# EAGLE design esp_wifi_switch (EAGLE 8.4.2)
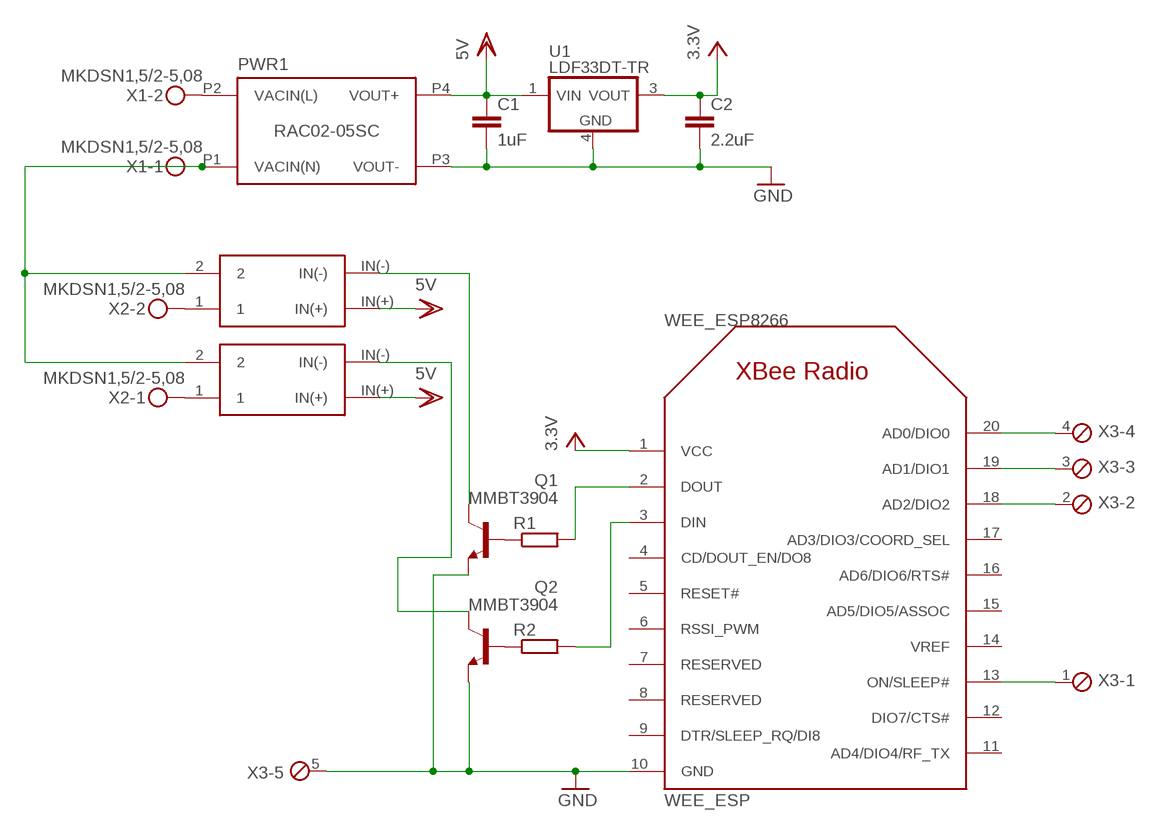
[diagram p0: schematic, sheet 1]

## Parts
C1  1uF  C-EUC3225  [C3225]
C2  2.2uF  C-EUC3225  [C3225]
PWR1  RAC02-05SC  [LOW_PROFILE_POWER_MODULE]
Q1  MMBT3904  BC849SMD  [SOT23-BEC]
Q2  MMBT3904  BC849SMD  [SOT23-BEC]
R1  R-EU_M1206  [M1206]
R2  R-EU_M1206  [M1206]
U1  LDF33DT-TR  MC7805BDT  [DPAK-3]
U$1  G3MB  [G3MB]
U$2  G3MB  [G3MB]
WEE_ESP8266  WEE_ESP  XBEE  [XBEE]
X1  MKDSN1,5/2-5,08  [MKDSN1,5/2-5,08]
X2  MKDSN1,5/2-5,08  [MKDSN1,5/2-5,08]
X3  MPT5  [5POL254]

## Nets
GND: C1.2 C2.2 PWR1.P3(VOUT-) Q1.E Q2.E U1.4(GND) WEE_ESP8266.10(GND) X3.5
N$1: PWR1.P2(VACIN(L)) X1.2
N$2: PWR1.P1(VACIN(N)) U$1.2 U$2.2 X1.1
N$3: U$1.1 X2.2
N$4: U$2.1 X2.1
N$5: WEE_ESP8266.13(ON/SLEEP#) X3.1
N$6: WEE_ESP8266.18(AD2/DIO2) X3.2
N$7: WEE_ESP8266.19(AD1/DIO1) X3.3
N$8: WEE_ESP8266.20(AD0/DIO0) X3.4
N$9: Q1.B R1.1
N$10: Q2.B R2.1
N$11: Q1.C U$1.IN(-)
N$12: R1.2 WEE_ESP8266.2(DOUT)
N$13: R2.2 WEE_ESP8266.3(DIN)
N$14: Q2.C U$2.IN(-)
VDD: C1.1 PWR1.P4(VOUT+) U1.1(VIN) U$1.IN(+) U$2.IN(+) ; supply symbol labelled 5V
VOUT: C2.1 U1.3(VOUT) WEE_ESP8266.1(VCC) ; supply symbol labelled 3.3V
Unconnected: WEE_ESP8266.4(CD/DOUT_EN/DO8) WEE_ESP8266.5(RESET#) WEE_ESP8266.6(RSSI_PWM) WEE_ESP8266.7(RESERVED) WEE_ESP8266.8(RESERVED) WEE_ESP8266.9(DTR/SLEEP_RQ/DI8) WEE_ESP8266.11(AD4/DIO4/RF_TX) WEE_ESP8266.12(DIO7/CTS#) WEE_ESP8266.14(VREF) WEE_ESP8266.15(AD5/DIO5/ASSOC) WEE_ESP8266.16(AD6/DIO6/RTS#) WEE_ESP8266.17(AD3/DIO3/COORD_SEL)

## Library data of the parts
C1 C2 = rcl:C-EU: CAPACITOR, European symbol
PWR1 = recom-powerline-acdc-converters:RAC*SC: RECOM POWERLINE AC/DC-Converter (RAC01-SC and RAC02-SC series) The RAC01-SC and RAC02-SC series are ultra-compact universal input AC/DC power modules for PCB mounting. They feature high efficiency, low standby power, high operating temperature, soft start and short-circuit protection as well as a built-in EMC Class B filter. Output voltages range from 3.3VDC to 24VDC. Datasheet <http://www.recom-power.com/pdf/Powerline-AC-DC/RAC01_02-SC.pdf>; INPUT_RANGE: 80 - 277 (VAC); MAX_CAPACITIVE_LOAD: 1200uF; OUTPUT_CURRENT: 400mA; OUTPUT_VOLTAGE: 5v
Q1 Q2 = transistor-npn:BC849*: NPN Transistor
R1 R2 = rcl:R-EU_: RESISTOR, European symbol
U1 = _hhn_78xx_79xx_NCV78xx_d2pak_dpak:MC78*: 78xx SMD (D2PAK, DPAK) (MC)78xx..DT (DPAK-3; Rth,JA = 92 K/W) (MC)78xx..D2T (D2PAK-3; Rth,JA = 45 K/W @ 10x10mm copper area) Linear Voltage Regulators, Positive, 1 A (ON Semiconductor) Package dimenisions and soldering footprints acc. to ONSEMI specs. Source: http://onsemi.com Datasheet document#: MC7800/D Technologies: 78xxyD(2)Tz: xx = Output Voltage (V) y, z: additional suffixes see manufacturer's datasheet Author: Dipl.-Ing. FH Rainer Bayer HHN Hochschule Heilbronn, rainer.bayer@hs-heilbronn.de Ingenieurbüro ing-rb, mail@ing-rb.de
U$1 U$2 = G3MB:G3MB
WEE_ESP8266 = xbee_r1:XBEE
X1 X2 = con-phoenix-508:MKDSN1,5/2-5,08: MKDSN 1,5/ 2-5,08 Printklemme Nennstrom: 13,5 A Nennspannung: 250 V Rastermaß: 5,08 mm Polzahl: 2 Anschlussart: Schraubanschluss Montage: Löten Anschlussrichtung Leiter/Platine: 0 ° Artikelnummer: 1729128 Source: http://eshop.phoenixcontact.com .. 1729128.pdf
X3 = con-phoenix-254:MPT5: PHOENIX CONNECTOR; OC_FARNELL: unknown; OC_NEWARK: unknown

## Board
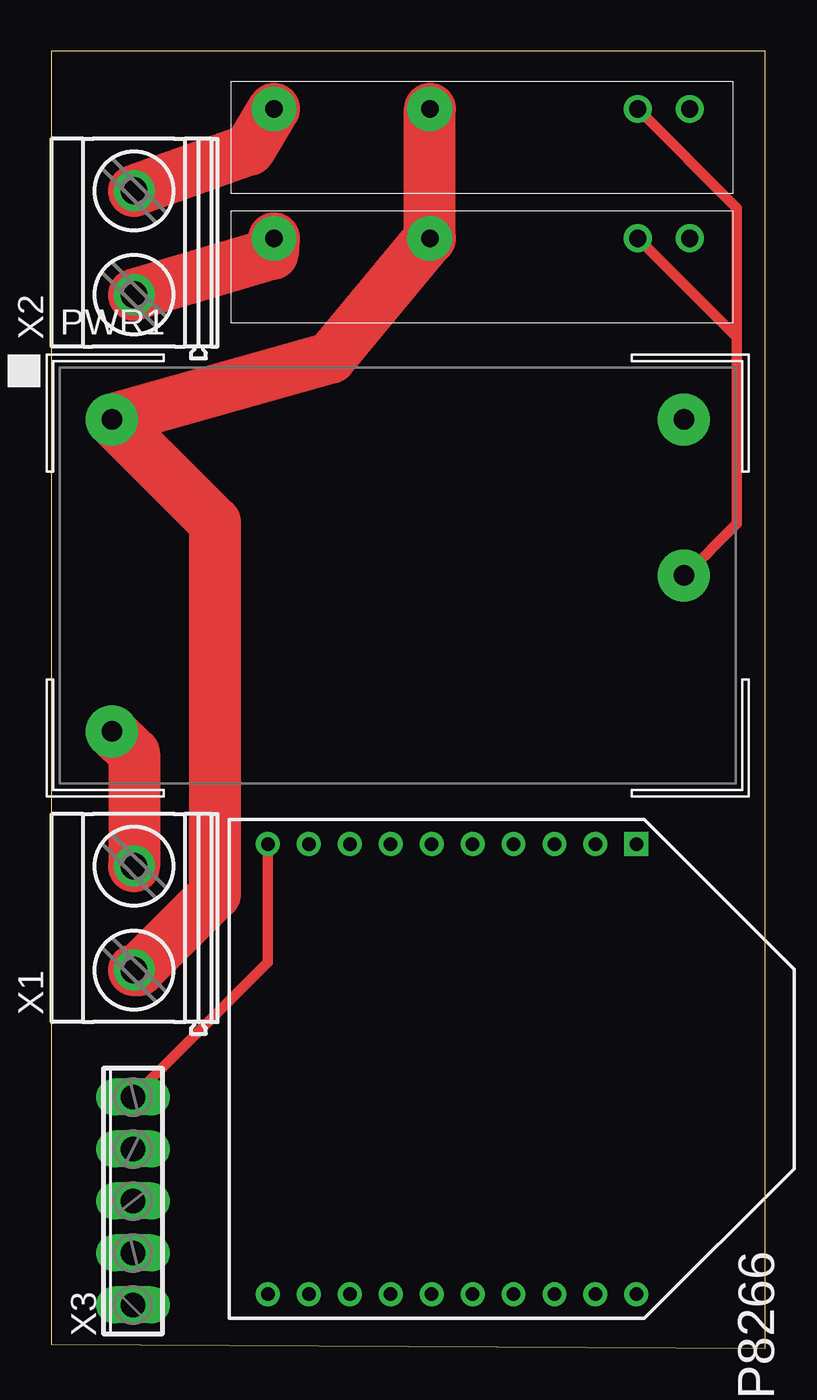
[diagram p1: board, top side]
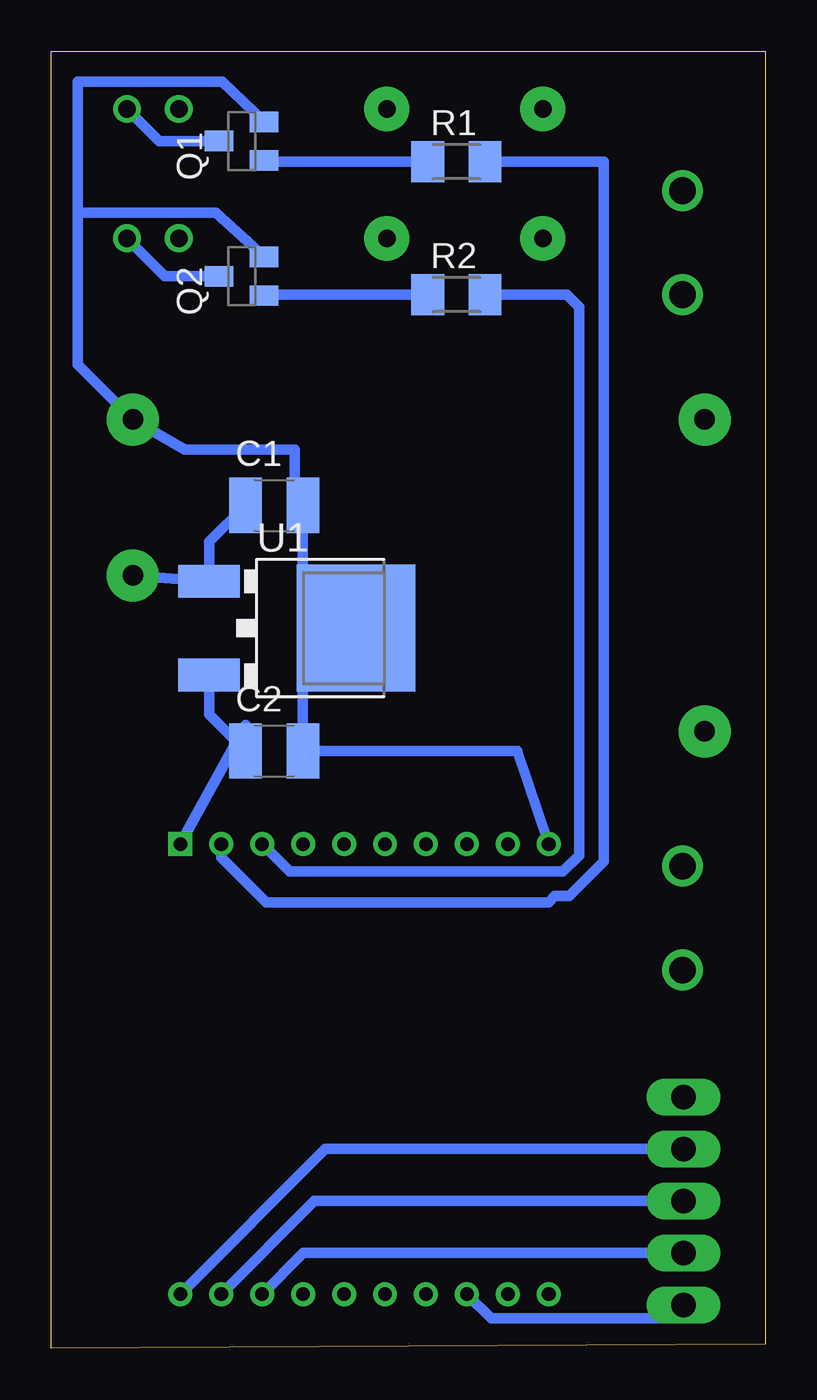
[diagram p2: board, bottom side, seen from below]

Size 34.9 x 63.4 mm. Coordinates in mm from the lower left corner, seen from the top.
Outline: 0,0.2 34.9,0 34.9,63.4 0,63.4 0,0.2
Copper layers (1*16): Top 0.035mm / dielectric 1.5mm / Bottom 0.035mm
Design rules "default": minimum track width 6mil, minimum drill 0.35mm, track to track 6mil, track to pad 6mil, pad to pad 6mil, via to via 6mil, smd to smd 6mil, copper to edge 40mil, drill to drill 6mil, minimum pad ring 10mil, minimum via ring 8mil, stop-mask expansion 4mil, vias tented up to drill 0mil, thermal gap 10mil

### Footprints (pad centres in the part's own frame; a part is rotated, then mirrored left to right if it is on the bottom)
C3225 = smd 1.6 x 2.7: 1 -1.4,0; 2 1.4,0
LOW_PROFILE_POWER_MODULE = drill 1 pad 2.54: P1 -12.7,7.62; P2 -12.7,-7.62; P3 15.24,7.62; P4 15.24,0
SOT23-BEC = smd 1 x 1.4: B -0.95,-1.1; C 0,1.1; E 0.95,-1.1
M1206 = smd 1.6 x 2: 1 -1.4,0; 2 1.4,0
DPAK-3 = smd 1.6 x 3: 1 -2.286,-7.18; 3 2.286,-7.18 | smd 6.2 x 5.8: 4 0,0
G3MB = drill 0.85 pad 2.184: 1 22.41,1.35; 2 14.79,1.35 | drill 0.85: IN(+) 4.63,1.35; IN(-) 2.09,1.35
XBEE = drill 0.66 square: 1 -11,9 | drill 0.66: 2 -11,7; 3 -11,5; 4 -11,3; 5 -11,1; 6 -11,-1; 7 -11,-3; 8 -11,-5; 9 -11,-7; 10 -11,-9; 11 11,-9; 12 11,-7; 13 11,-5; 14 11,-3; 15 11,-1; 16 11,1; 17 11,3; 18 11,5; 19 11,7; 20 11,9
MKDSN1,5/2-5,08 = drill 1.3 pad 2: 1 -2.561,0.025; 2 2.519,0.025
5POL254 = drill 1.2 long: 1 -5.08,0; 2 -2.54,0; 3 0,0; 4 2.54,0; 5 5.08,0

### Placement (x,y rotation side)
C1  24,41.2 0 bottom
C2  24,29.2 0 bottom
PWR1  15.67,37.78 0 top
Q1  25.6,59 90 bottom
Q2  25.6,52.4 90 bottom
R1  15.1,58 0 bottom
R2  15.1,51.5 0 bottom
U1  20,35.2 270 bottom
U$1  33.29,61.93 180 top
U$2  33.29,55.6 180 top
WEE_ESP8266  19.59,13.65 270 top
X1  4.08,21.05 90 top
X2  4.08,54.06 90 top
X3  4,7.2 90 top

### Tracks (layer width: path | path; a pad name or v marks a point on that pad's centre or on a via)
GND
  Top 0.508: X3.5 10.59,18.87 WEE_ESP8266.10
  Bottom 0.508: WEE_ESP8266.10 12.14,29.2 C2.2 22.6,32.6 U1.4 22.6,37.8 C1.2 23,41.6 23,43.93 28.38,43.93 PWR1.P3 33.6,48.09 33.6,55.5 | Q2.E 26.85,55.5 33.6,55.5 | Q1.E 26.55,61.9 33.6,61.9 33.6,55.5
N$1
  Top 2.54: PWR1.P2 4.05,29.07 X1.2
N$2
  Top 2.54: U$1.2 U$2.2 13.65,48.4 PWR1.P1 8,40.37 8,22.2 4.29,18.49 X1.1
N$3
  Top 2.54: U$1.1 9.67,58.58 X2.2
N$4
  Top 2.54: U$2.1 10.82,53.5 X2.1
N$5
  Bottom 0.508: WEE_ESP8266.13 13.41,1.47 4.65,1.47 X3.1
N$6
  Bottom 0.508: X3.2 22.58,4.66 WEE_ESP8266.18
N$7
  Bottom 0.508: X3.3 22.04,7.2 WEE_ESP8266.19
N$8
  Bottom 0.508: X3.4 21.5,9.74 WEE_ESP8266.20
N$9
  Bottom 0.508: R1.1 24.45,58 Q1.B
N$10
  Bottom 0.508: R2.1 24.45,51.5 Q2.B
N$11
  Bottom 0.508: Q1.C 29.62,59 U$1.IN(-)
N$12
  Bottom 0.508: WEE_ESP8266.2 26.59,23.99 24.4,21.8 10.6,21.8 10.3,22.1 9.6,22.1 7.9,23.8 7.9,58 R1.2
N$13
  Bottom 0.508: WEE_ESP8266.3 23.24,23.3 9.9,23.3 9.1,24.1 9.1,50.9 9.7,51.5 R2.2
N$14
  Bottom 0.508: Q2.C 29.35,52.4 U$2.IN(-)
VDD
  Top 0.508: PWR1.P4 30.98,37.78 33.5,40.3 33.5,49.41 | 33.5,49.41 U$2.IN(+) | 33.5,49.41 33.5,55.74 U$1.IN(+)
  Bottom 0.508: PWR1.P4 30.89,37.78 U1.1 27.18,39.42 C1.1
VOUT
  Bottom 0.508: U1.3 27.18,30.98 C2.1 25.4,30.46 WEE_ESP8266.1